# Altium schematic sheet power-input.SchDoc
size A4; SheetNumber: 2
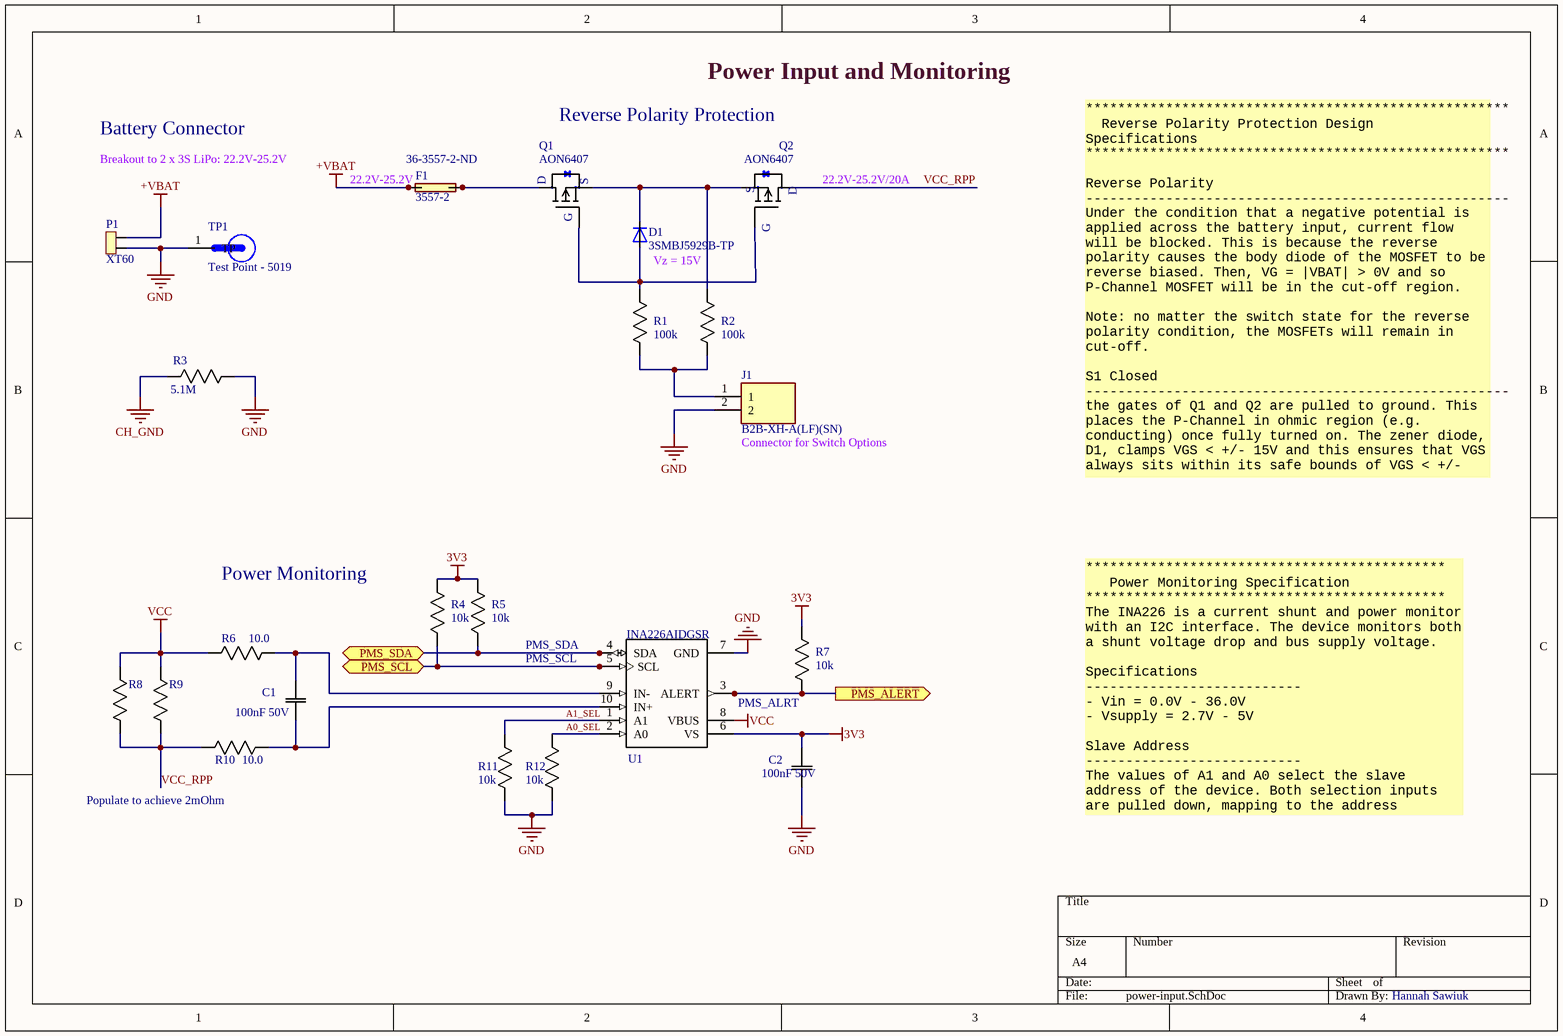
[diagram p0: power-input.SchDoc]

## Parts
C1  100nF 50V  [0805]
C2  100nF 50V  [0805]
D1  3SMBJ5929B-TP  [SOD-123]
F1  3557-2  Supplier Part Number 1: 36-3557-2-ND  [FUSE-3549-2]
J1  B2B-XH-A(LF)(SN)  [JST_B2B-XH-A(LF)(SN)]
P1  XT60  [Amass_XT60PW-M]
PMS_ALRT  Test Point (Via)  [TP]  (value not drawn)
PMS_SCL  Test Point (Via)  [TP]  (value not drawn)
PMS_SDA  Test Point (Via)  [TP]  (value not drawn)
Q1  AON6407  [8-PowerSMD]
Q2  AON6407  [8-PowerSMD]
R1  100k  [0805]
R2  100k  [0805]
R3  5.1M  [0805]
R4  10k  [0805]
R5  10k  [0805]
R6  10.0  [0805]
R7  10k  [0805]
R8  2mOHM  [2512]  (value not drawn)
R9  2mOHM  [2512]  (value not drawn)
R10  10.0  [0805]
R11  10k  [0805]
R12  10k  [0805]
TP1  Test Point - 5019  [TP380X203]
U1  INA226AIDGSR  [10-VSSOP]

## Ports
PMS_ALERT (out), PMS_SCL (bidir), PMS_SDA (bidir)

## Nets
3V3: C2.2(C2) R4.1(R1) R5.1(R1) R7.1(R1) U1.6(VS)
+VBAT: F1.3(2A) F1.4(2B) P1.2
CH_GND: R3.2(R2)
GND: C2.1(C1) J1.2 P1.1 R3.1(R1) R11.2(R2) R12.2(R2) TP1.1(TP) U1.7(GND)
VCC: R6.2(R2) R8.1(R1) R9.1(R1) U1.8(VBUS)
A0_SEL: R12.1(R1) U1.2(A0)
A1_SEL: R11.1(R1) U1.1(A1)
PMS_ALERT: PMS_ALRT.1 R7.2(R2) U1.3(ALERT) ; port PMS_ALERT
PMS_SCL: PMS_SCL.1 R4.2(R2) U1.5(SCL) ; port PMS_SCL
PMS_SDA: PMS_SDA.1 R5.2(R2) U1.4(SDA) ; port PMS_SDA
VCC_RPP: Q2.D R8.2(R2) R9.2(R2) R10.2(R2)
NetC1_1: C1.1(C1) R10.1(R1) U1.10(IN+)
NetC1_2: C1.2(C2) R6.1(R1) U1.9(IN-)
NetD1_A: D1.A Q1.G Q2.G R1.1(R1)
NetD1_C: D1.C Q1.S Q2.S R2.1(R1)
NetF1_1: F1.1(1A) F1.2(1B) Q1.D
NetJ1_1: J1.1 R1.2(R2) R2.2(R2)

## Notes on the sheet
- Power Input and Monitoring
- Battery Connector
- Breakout to 2 x 3S LiPo: 22.2V-25.2V
- Reverse Polarity Protection
- (near F1) 22.2V-25.2V
- (near Q2) 22.2V-25.2V/20A
- Vz = 15V
- (near J1) Connector for Switch Options
- *****************************************************
  Reverse Polarity Protection Design Specifications
  *****************************************************
  Reverse Polarity
  -----------------------------------------------------
  Under the condition that a negative potential is applied across the battery input, current flow will be blocked. This is because the reverse polarity causes the body diode of the MOSFET to be reverse biased. Then, VG = |VBAT| > 0V and so P-Channel MOSFET will be in the cut-off region.
  Note: no matter the switch state for the reverse polarity condition, the MOSFETs will remain in cut-off.
  S1 Closed
  -----------------------------------------------------
  the gates of Q1 and Q2 are pulled to ground. This places the P-Channel in ohmic region (e.g. conducting) once fully turned on. The zener diode, D1, clamps VGS < +/- 15V and this ensures that VGS always sits within its safe bounds of VGS < +/- 25V.
- Power Monitoring
- Populate to achieve 2mOhm
- *********************************************
  Power Monitoring Specification
  *********************************************
  The INA226 is a current shunt and power monitor
  with an I2C interface. The device monitors both a shunt voltage drop and bus supply voltage.
  Specifications
  ---------------------------
  - Vin = 0.0V - 36.0V
  - Vsupply = 2.7V - 5V
  Slave Address
  ---------------------------
  The values of A1 and A0 select the slave address of the device. Both selection inputs are pulled down, mapping to the address 1000000.
- Hannah Sawiuk

## Library data of the parts
C1 C2 = CAP 100nF 50V: CAP CER 0.1UF 50V X7R 0805; Tolerance: 10%; Package: 0805; Value: 100nF; Rating: 50V
D1 = DIODE ZENER 15V 3W: Supplier 1: Digi-Key; Supplier Part Number 1: 3SMBJ5929BTPMSCT-ND
F1 = FUSE BLADE: Fuse Block 30A 500V 1 Circuit Blade Through Hole; MF: Keystone Electronics; Package: Nonstandard Keystone; Value: *; Price: None; MP: 3557-2; SnapEDA_Link: https://www.snapeda.com/parts/3557-2/Keystone%20Electronics/view-part/278060/?ref=snap; Availability: Unavailable; Supplier 1: Digi-Key
J1 = B2B-XH-A(LF)(SN): Connector Header Through Hole 2 position 0.098 _2.50mm_ / JST XH; MP: B2B-XH-A_LF__SN_; MF: JST Sales; Price: None; Package: None; Value: *; Availability: Unavailable; SnapEDA_Link: https://www.snapeda.com/parts/B2B-XH-A%28LF%29%28SN%29/JST%20Sales%20America%20Inc./view-part/492310/?ref=snap
P1 = XT60 Connector: XT60 CONNECTORS FEMALE PAIR; MF: SparkFun Electronics; MP: PRT-10474; Digikey: 1568-1816-ND; Digikey Link: https://www.digikey.ca/product-detail/en/sparkfun-electronics/PRT-10474/1568-1816-ND/8258064; Package: XT60; Price: 2.13000 CAD; Value: N/A; Supplier 1: Digi-Key; Supplier Part Number 1: 1568-1816-ND
Q1 Q2 = MOSFET AON6407: MOSFET P-CH 30V 32A 8DFN; MF: Alpha & Omega Semiconductor Inc.; Package: 8-PowerSMD; MP: AON6407; Digikey: 785-1421-1-ND; Digikey Link: https://www.digikey.ca/product-detail/en/alpha-omega-semiconductor-inc/AON6407/785-1421-1-ND/3466800; Supplier 1: Digi-Key; Supplier Part Number 1: 785-1421-1-ND
R1 R2 = RES 100k 1/8W - 1%: RES SMD 100K OHM 1% 1/8W 0805; Power (Watts): 0.125W; Package: 0805; Value: 100k; Tolerance: 1%
R3 = RES 5.1M 1/8W-5%: RES SMD 5.1 MOHM 5% 1/8W 0805; Power (Watts): 0.125W; Package: 0805; Value: 5.1M; Tolerance: 5%
R4 R5 R7 R11 R12 = RES 10k 1/8W - 1%: RES SMD 10K OHM 1% 1/8W 0805; Power (Watts): 0.125W; Package: 0805; Value: 10k; Tolerance: 1%
R6 R10 = RES 10.0 1/8W - 1%: RES SMD 10.0 OHM 1% 1/8W 0805; Power (Watts): 0.125W; Package: 0805; Value: 10.0; Tolerance: 1%
R8 R9 = RES 2m 1W: RES SMD 2m OHM 1% 1W 1206; Package: 1206; Resistance: 2mOHM; Power (Watts): 1W; Tolerance: 1%
TP1 = Test Point - 5019: PC Test Point, Miniature Phosphor Bronze, Silver Plating Surface Mount Mounting Type; MP: 5019; MF: Keystone Electronics; Value: *; Package: 2010 Keystone; Digi-Key_Part_Number: 36-5019CT-ND; Digi-Key_Purchase_URL: https://www.digikey.com/product-detail/en/keystone-electronics/5019/36-5019CT-ND/3907344?utm_source=snapeda&utm_medium=aggregator&utm_campaign=symbol
U1 = IC INA226AIDGSR: 36-V, Bi-Directional, Ultra-High Accuracy, Low-/High-Side, I2C Out Current/Power Monitor w/ Alert 10-VSSOP -40 to 125; MF: Texas Instruments; Price: None; MP: INA226AIDGSR; SnapEDA_Link: https://www.snapeda.com/parts/INA226AIDGSR/Texas%20Instruments/view-part/53552/?ref=snap; Package: MSOP-10 Texas Instruments; Digikey: 296-29034-1-ND; Digikey Link: https://www.digikey.ca/product-detail/en/texas-instruments/INA226AIDGSR/296-29034-1-ND/2687118; Supplier 1: Digi-Key; Supplier Part Number 1: 296-29034-6-ND